# EAGLE schematic CurrentMeter2 (EAGLE 9.4.2)
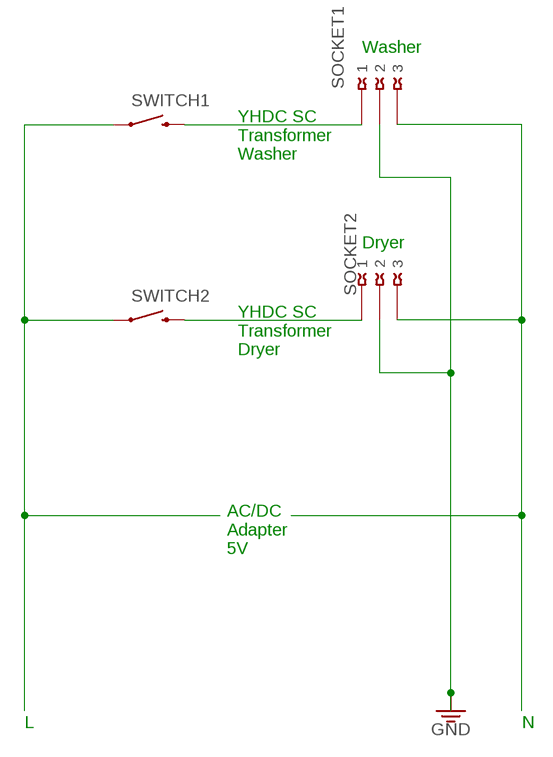
[diagram p0: schematic, sheet 1]

## Parts
SOCKET1  009175003  [009175003]
SOCKET2  009175003  [009175003]
SWITCH1  RS032G05A3SM-SPST-MOMENTARY-SWSMD-1101NE  [TACTILE-SWITCH-1101NE]
SWITCH2  RS032G05A3SM-SPST-MOMENTARY-SWSMD-1101NE  [TACTILE-SWITCH-1101NE]

## Nets
3.3V: SOCKET1.2@1 SOCKET2.2@1 ; supply symbol labelled GND
N$1: SWITCH1.1 SWITCH2.1
N$2: SOCKET1.1@1 SWITCH1.2
N$3: SOCKET2.1@1 SWITCH2.2
N$4: SOCKET1.3@2 SOCKET2.3@2
Unconnected: SOCKET1.1 SOCKET1.2 SOCKET1.3 SOCKET2.1 SOCKET2.2 SOCKET2.3

## Notes on the sheet
- Washer
- YHDC SC
  Transformer
  Washer
- Dryer
- YHDC SC
  Transformer
  Dryer
- AC/DC
  Adapter
  5V
- L | N

## Library data of the parts
SOCKET1 SOCKET2 = con-avx:009175003: Wire to Board IDC Connector 3 WAY Source: http://www.avx.com/docs/Catalogs/9175.pdf; MPN: 009175003001006; OC_FARNELL: 1387485; OC_NEWARK: 40M7661
SWITCH1 SWITCH2 = BeagleBone_Blue_R3:RS032G05A3SM-SPST-MOMENTARY-SW: 6x3.5mm 2-pin Momentary Switch (Push-button) Digikey Link <https://www.digikey.com/products/en?keywords=CKN10388TR-ND> Datasheet <https://media.digikey.com/pdf/Data%20Sheets/C&K/RS-032G05_-SM_RT.pdf>; PROD_ID: SWCH-00815